# Altium schematic sheet Q24brakelightsch.SchDoc
size A4; SheetNumber: 1; SheetTotal: 1
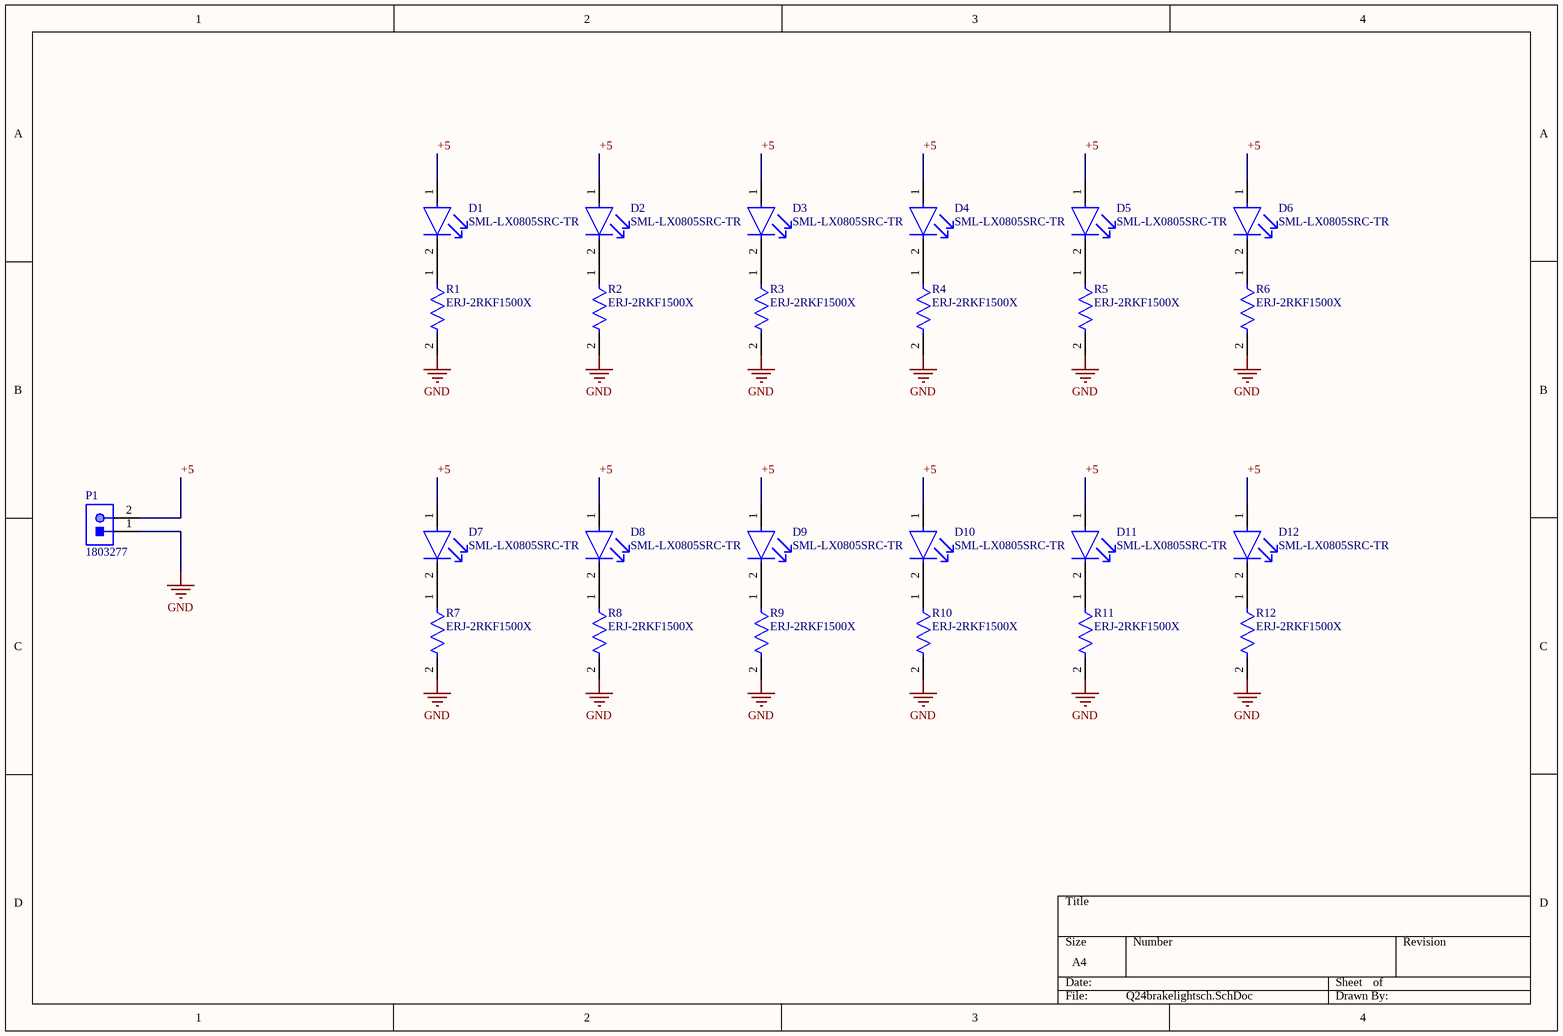
[diagram p0: Q24brakelightsch.SchDoc]

## Parts
D1  SML-LX0805SRC-TR  [FP-SML-LX0805SRC-TR-MFG]
D2  SML-LX0805SRC-TR  [FP-SML-LX0805SRC-TR-MFG]
D3  SML-LX0805SRC-TR  [FP-SML-LX0805SRC-TR-MFG]
D4  SML-LX0805SRC-TR  [FP-SML-LX0805SRC-TR-MFG]
D5  SML-LX0805SRC-TR  [FP-SML-LX0805SRC-TR-MFG]
D6  SML-LX0805SRC-TR  [FP-SML-LX0805SRC-TR-MFG]
D7  SML-LX0805SRC-TR  [FP-SML-LX0805SRC-TR-MFG]
D8  SML-LX0805SRC-TR  [FP-SML-LX0805SRC-TR-MFG]
D9  SML-LX0805SRC-TR  [FP-SML-LX0805SRC-TR-MFG]
D10  SML-LX0805SRC-TR  [FP-SML-LX0805SRC-TR-MFG]
D11  SML-LX0805SRC-TR  [FP-SML-LX0805SRC-TR-MFG]
D12  SML-LX0805SRC-TR  [FP-SML-LX0805SRC-TR-MFG]
P1  1803277  [PHOE-1803277_V]
R1  ERJ-2RKF1500X  [FP-ERJ2RK-IPC_A]
R2  ERJ-2RKF1500X  [FP-ERJ2RK-IPC_A]
R3  ERJ-2RKF1500X  [FP-ERJ2RK-IPC_A]
R4  ERJ-2RKF1500X  [FP-ERJ2RK-IPC_A]
R5  ERJ-2RKF1500X  [FP-ERJ2RK-IPC_A]
R6  ERJ-2RKF1500X  [FP-ERJ2RK-IPC_A]
R7  ERJ-2RKF1500X  [FP-ERJ2RK-IPC_A]
R8  ERJ-2RKF1500X  [FP-ERJ2RK-IPC_A]
R9  ERJ-2RKF1500X  [FP-ERJ2RK-IPC_A]
R10  ERJ-2RKF1500X  [FP-ERJ2RK-IPC_A]
R11  ERJ-2RKF1500X  [FP-ERJ2RK-IPC_A]
R12  ERJ-2RKF1500X  [FP-ERJ2RK-IPC_A]

## Nets
GND: P1.1 R1.2 R2.2 R3.2 R4.2 R5.2 R6.2 R7.2 R8.2 R9.2 R10.2 R11.2 R12.2
+5: D1.1(A) D2.1(A) D3.1(A) D4.1(A) D5.1(A) D6.1(A) D7.1(A) D8.1(A) D9.1(A) D10.1(A) D11.1(A) D12.1(A) P1.2
NetD1_2: D1.2(C) R1.1
NetD2_2: D2.2(C) R2.1
NetD3_2: D3.2(C) R3.1
NetD4_2: D4.2(C) R4.1
NetD5_2: D5.2(C) R5.1
NetD6_2: D6.2(C) R6.1
NetD7_2: D7.2(C) R7.1
NetD8_2: D8.2(C) R8.1
NetD9_2: D9.2(C) R9.1
NetD10_2: D10.2(C) R10.1
NetD11_2: D11.2(C) R11.1
NetD12_2: D12.2(C) R12.1

## Library data of the parts
D1-D12 = CMP-57192-000013-1: LED RED CLEAR SMD; Forward Current: 20mA; Wavelength: 660nm; Forward Voltage: 1.7V; Luminous Intensity: 25mcd; Number of LEDs: 1; Current Rating: 25mA; Lens Color: Colorless; Power Rating: 100mW; Viewing Angle: 140°; Approvals: UL; Lens Transparency: Clear; Series: -; Package Quantity: 3000; Mount: Surface Mount; Lead Free: Lead Free; Case/Package: 0805; Max Operating Temperature: 85°C; Illumination Color: Red; Packaging: Tape and Reel; Length: 2mm; Lens Style: Clear; Width: 1.25mm; RoHS Compliant: Yes; Color: Red; Case Code (Metric): 2012; Dominant Wavelength: 660nm; Number of Pins: 2; Min Operating Temperature: -40°C; Case Code (Imperial): 0805; Voltage Rating (DC): 1.7V; Voltage Rating: 1.7V; Height: 1.2mm; Test Current: 20mA
P1 = CMP-002-00014-2: Male Header, Pitch 3.81 mm, 1 x 2 Position, Height 7.25 mm, Tail Length 3.4 mm, RoHS, Bulk; Manufacturer: Phoenix Contact; Voltage Rating: 160V; Current Rating: 8A; Rows: 1; Mounting Technology: TH; Contact Plating: Tin; Case/Package: 1803277; Gender: Male; Diameter: 7.25mm; Datasheet Version: Feb-14; Colour: Green; Pins: 2; Lead Pitch: 0.15inch; Connector Type: Header; Package Quantity: 50; Max Current Rating: 8A; Manufacturer URL: http://www.phoenixcontact.com/; Packaging: Bulk; RoHS Compliant: True; Datasheet URL: https://datasheet.ciiva.com/16096/1803277-16096845.pdf; Package Reference: 1803277; Package Description: Male Header, Pitch 3.81 mm, 1 x 2 Position, Height 7.25 mm, Tail Length 3.4 mm
R1-R12 = CMP-1011-00415-3: RES SMD 150 OHM 1% 1/10W 0402; Resistance: 150R; Voltage Rating: 50V; Power Rating: 100mW; Temperature Coefficient: 100ppm/°C; Mount: Surface Mount; Tolerance: 1%; Height: 0.35mm; Resistance Tolerance: 1%; Package Quantity: 1; REACH SVHC: No SVHC; Number of Terminations: 2; Number of Pins: 2; Length: 1mm; Size Code: 0402; Min Operating Temperature: -55°C; Features: Automotive AEC-Q200; Contact Plating: Tin; Voltage Rating (DC): 50V; Series: ERJ; Depth: 0.5mm; Case Code (Metric): 1005; Case/Package: 0402; Construction: Rectangular; RoHS Compliant: Yes; Case Code (Imperial): 0402; Packaging: Tape and Reel; Max Operating Temperature: 155°C; Termination: SMD/SMT; Radiation Hardening: No; Lead Free: Lead Free; Military Standard: Not; Technology: THICK FILM; Width: 0.02inch; Max Power Dissipation: 100mW; Resistor Type: Thick Film